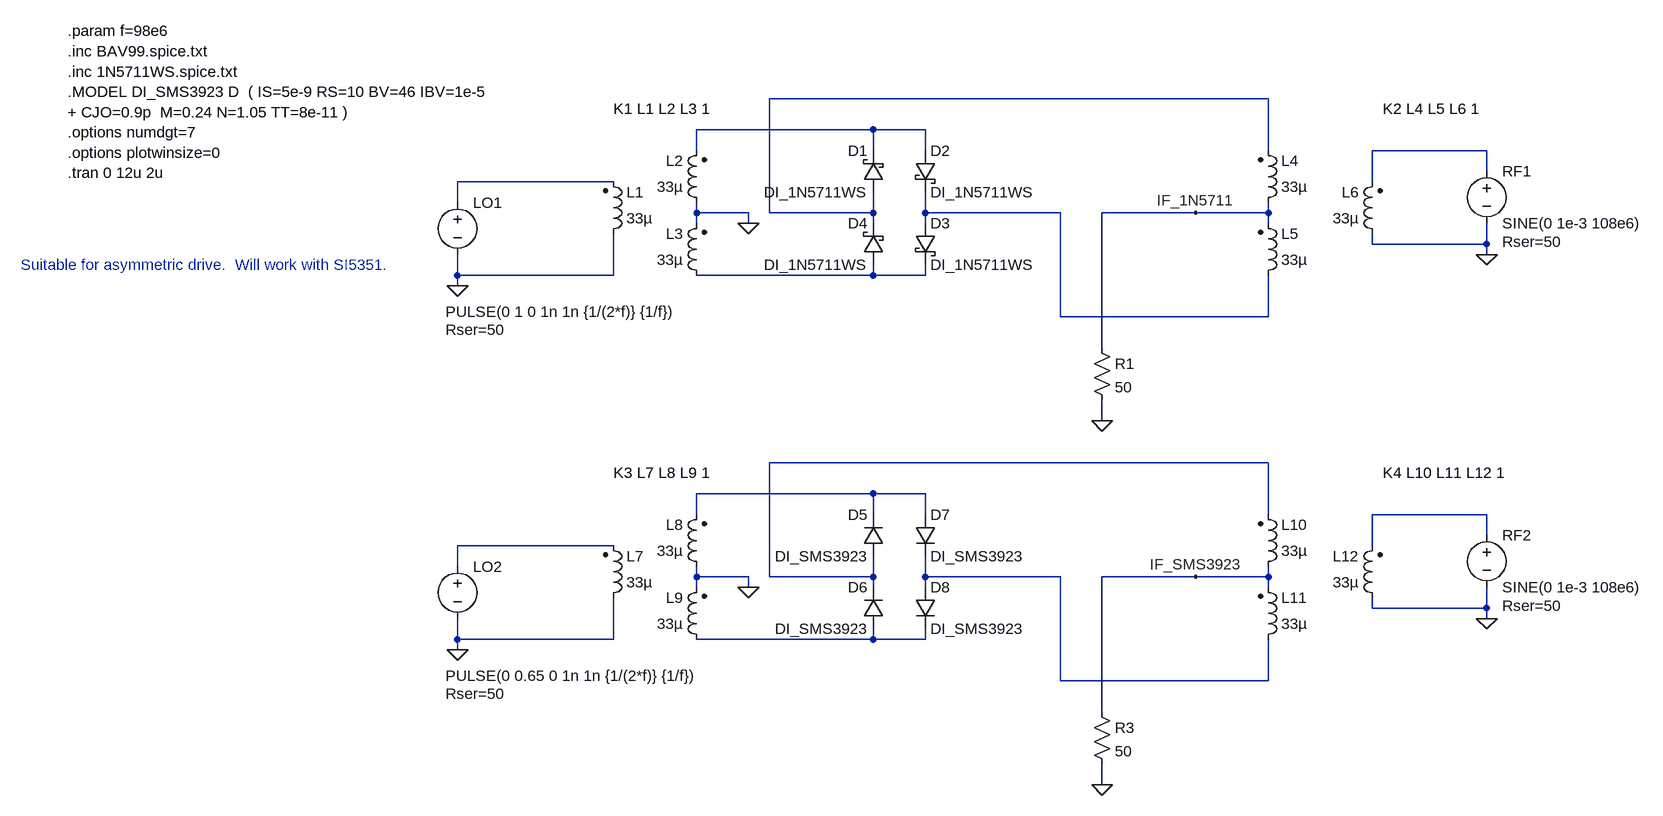
[diagram p0: schematic DBM_Diode_comparison.asc]
DBM_Diode_comparison.asc, the LTspice schematic file:
Version 4.1
SHEET 1 1380 964
WIRE 784 -112 16 -112
WIRE 176 -64 -96 -64
WIRE 256 -64 176 -64
WIRE -96 -32 -96 -64
WIRE 176 -32 176 -64
WIRE 256 -32 256 -64
WIRE 784 -32 784 -112
WIRE 1120 -32 944 -32
WIRE 1120 0 1120 -32
WIRE -224 16 -464 16
WIRE 944 16 944 -32
WIRE -464 48 -464 16
WIRE -96 64 -96 48
WIRE -16 64 -96 64
WIRE 16 64 16 -112
WIRE 176 64 176 32
WIRE 176 64 16 64
WIRE 256 64 256 32
WIRE 464 64 256 64
WIRE 672 64 528 64
WIRE 784 64 784 48
WIRE 784 64 672 64
WIRE -96 80 -96 64
WIRE -16 80 -16 64
WIRE 176 80 176 64
WIRE 256 80 256 64
WIRE 784 80 784 64
WIRE 944 112 944 96
WIRE 1120 112 1120 80
WIRE 1120 112 944 112
WIRE 1120 128 1120 112
WIRE -464 160 -464 128
WIRE -224 160 -224 96
WIRE -224 160 -464 160
WIRE 176 160 176 144
WIRE 176 160 -96 160
WIRE 256 160 256 144
WIRE 256 160 176 160
WIRE -464 176 -464 160
WIRE 464 224 464 64
WIRE 784 224 784 160
WIRE 784 224 464 224
WIRE 528 272 528 64
WIRE 528 384 528 352
WIRE 784 448 16 448
WIRE 176 496 -96 496
WIRE 256 496 176 496
WIRE -96 528 -96 496
WIRE 176 528 176 496
WIRE 256 528 256 496
WIRE 784 528 784 448
WIRE 1120 528 944 528
WIRE 1120 560 1120 528
WIRE -224 576 -464 576
WIRE 944 576 944 528
WIRE -464 608 -464 576
WIRE -96 624 -96 608
WIRE -16 624 -96 624
WIRE 16 624 16 448
WIRE 176 624 176 592
WIRE 176 624 16 624
WIRE 256 624 256 592
WIRE 464 624 256 624
WIRE 672 624 528 624
WIRE 784 624 784 608
WIRE 784 624 672 624
WIRE -96 640 -96 624
WIRE -16 640 -16 624
WIRE 176 640 176 624
WIRE 256 640 256 624
WIRE 784 640 784 624
WIRE 944 672 944 656
WIRE 1120 672 1120 640
WIRE 1120 672 944 672
WIRE 1120 688 1120 672
WIRE -464 720 -464 688
WIRE -224 720 -224 656
WIRE -224 720 -464 720
WIRE 176 720 176 704
WIRE 176 720 -96 720
WIRE 256 720 256 704
WIRE 256 720 176 720
WIRE -464 736 -464 720
WIRE 464 784 464 624
WIRE 784 784 784 720
WIRE 784 784 464 784
WIRE 528 832 528 624
WIRE 528 944 528 912
FLAG -16 80 0
FLAG -464 176 0
FLAG 1120 128 0
FLAG 528 384 0
FLAG 672 64 IF_1N5711
FLAG -16 640 0
FLAG -464 736 0
FLAG 1120 688 0
FLAG 528 944 0
FLAG 672 624 IF_SMS3923
DATAFLAG -368 576 ""
SYMBOL voltage -464 32 R0
WINDOW 3 -18 184 Left 2
WINDOW 123 0 0 Left 0
WINDOW 39 -18 212 Left 2
SYMATTR Value PULSE(0 1 0 1n 1n {1/(2*f)} {1/f})
SYMATTR SpiceLine Rser=50
SYMATTR InstName LO1
SYMBOL ind2 -240 112 M180
WINDOW 0 36 80 Left 2
WINDOW 3 36 40 Left 2
SYMATTR InstName L1
SYMATTR Value 33µ
SYMATTR Type ind
SYMBOL ind2 -80 64 R180
WINDOW 0 36 80 Left 2
WINDOW 3 36 40 Left 2
SYMATTR InstName L2
SYMATTR Value 33µ
SYMATTR Type ind
SYMBOL ind2 -80 176 R180
WINDOW 0 36 80 Left 2
WINDOW 3 36 40 Left 2
SYMATTR InstName L3
SYMATTR Value 33µ
SYMATTR Type ind
SYMBOL ind2 768 64 M180
WINDOW 0 36 80 Left 2
WINDOW 3 36 40 Left 2
SYMATTR InstName L4
SYMATTR Value 33µ
SYMATTR Type ind
SYMBOL ind2 768 176 M180
WINDOW 0 36 80 Left 2
WINDOW 3 36 40 Left 2
SYMATTR InstName L5
SYMATTR Value 33µ
SYMATTR Type ind
SYMBOL ind2 960 112 R180
WINDOW 0 36 80 Left 2
WINDOW 3 36 40 Left 2
SYMATTR InstName L6
SYMATTR Value 33µ
SYMATTR Type ind
SYMBOL schottky 192 32 R180
WINDOW 0 24 64 Left 2
WINDOW 3 24 0 Left 2
SYMATTR InstName D1
SYMATTR Value DI_1N5711WS
SYMATTR Description Diode
SYMATTR Type diode
SYMBOL voltage 1120 -16 R0
WINDOW 123 0 0 Left 0
WINDOW 39 24 124 Left 2
SYMATTR SpiceLine Rser=50
SYMATTR InstName RF1
SYMATTR Value SINE(0 1e-3 108e6)
SYMBOL res 512 256 R0
SYMATTR InstName R1
SYMATTR Value 50
SYMBOL schottky 240 -32 R0
SYMATTR InstName D2
SYMATTR Value DI_1N5711WS
SYMATTR Description Diode
SYMATTR Type diode
SYMBOL schottky 240 80 R0
SYMATTR InstName D3
SYMATTR Value DI_1N5711WS
SYMATTR Description Diode
SYMATTR Type diode
SYMBOL schottky 192 144 R180
WINDOW 0 24 64 Left 2
WINDOW 3 24 0 Left 2
SYMATTR InstName D4
SYMATTR Value DI_1N5711WS
SYMATTR Description Diode
SYMATTR Type diode
SYMBOL voltage -464 592 R0
WINDOW 3 -18 184 Left 2
WINDOW 123 0 0 Left 0
WINDOW 39 -18 212 Left 2
SYMATTR Value PULSE(0 0.65 0 1n 1n {1/(2*f)} {1/f})
SYMATTR SpiceLine Rser=50
SYMATTR InstName LO2
SYMBOL ind2 -240 672 M180
WINDOW 0 36 80 Left 2
WINDOW 3 36 40 Left 2
SYMATTR InstName L7
SYMATTR Value 33µ
SYMATTR Type ind
SYMBOL ind2 -80 624 R180
WINDOW 0 36 80 Left 2
WINDOW 3 36 40 Left 2
SYMATTR InstName L8
SYMATTR Value 33µ
SYMATTR Type ind
SYMBOL ind2 -80 736 R180
WINDOW 0 36 80 Left 2
WINDOW 3 36 40 Left 2
SYMATTR InstName L9
SYMATTR Value 33µ
SYMATTR Type ind
SYMBOL ind2 768 624 M180
WINDOW 0 36 80 Left 2
WINDOW 3 36 40 Left 2
SYMATTR InstName L10
SYMATTR Value 33µ
SYMATTR Type ind
SYMBOL ind2 768 736 M180
WINDOW 0 36 80 Left 2
WINDOW 3 36 40 Left 2
SYMATTR InstName L11
SYMATTR Value 33µ
SYMATTR Type ind
SYMBOL ind2 960 672 R180
WINDOW 0 36 80 Left 2
WINDOW 3 36 40 Left 2
SYMATTR InstName L12
SYMATTR Value 33µ
SYMATTR Type ind
SYMBOL voltage 1120 544 R0
WINDOW 123 0 0 Left 0
WINDOW 39 24 124 Left 2
SYMATTR SpiceLine Rser=50
SYMATTR InstName RF2
SYMATTR Value SINE(0 1e-3 108e6)
SYMBOL res 512 816 R0
SYMATTR InstName R3
SYMATTR Value 50
SYMBOL diode 192 592 R180
WINDOW 0 24 64 Left 2
WINDOW 3 24 0 Left 2
SYMATTR InstName D5
SYMATTR Value DI_SMS3923
SYMBOL diode 192 704 R180
WINDOW 0 24 64 Left 2
WINDOW 3 24 0 Left 2
SYMATTR InstName D6
SYMATTR Value DI_SMS3923
SYMBOL diode 240 528 R0
SYMATTR InstName D7
SYMATTR Value DI_SMS3923
SYMBOL diode 240 640 R0
SYMATTR InstName D8
SYMATTR Value DI_SMS3923
TEXT -224 -96 Left 2 !K1 L1 L2 L3 1
TEXT 960 -96 Left 2 !K2 L4 L5 L6 1
TEXT -1064 -216 Left 2 !.param f=98e6\n.inc BAV99.spice.txt\n.inc 1N5711WS.spice.txt\n.MODEL DI_SMS3923 D  ( IS=5e-9 RS=10 BV=46 IBV=1e-5\n+ CJO=0.9p  M=0.24 N=1.05 TT=8e-11 )\n.options numdgt=7\n.options plotwinsize=0\n.tran 0 12u 2u
TEXT -1136 144 Left 2 ;Suitable for asymmetric drive.  Will work with SI5351.
TEXT -224 464 Left 2 !K3 L7 L8 L9 1
TEXT 960 464 Left 2 !K4 L10 L11 L12 1

The netlist it stands for:
* DBM_Diode_comparison.asc
V§LO1 N004 0 PULSE(0 1 0 1n 1n {1/(2*f)} {1/f}) Rser=50
L1 0 N004 33µ
L2 0 N002 33µ
L3 N006 0 33µ
L4 IF_1N5711 N001 33µ
L5 N005 IF_1N5711 33µ
L6 0 N003 33µ
D1 N001 N002 DI_1N5711WS
V§RF1 N003 0 SINE(0 1e-3 108e6) Rser=50
R1 IF_1N5711 0 50
D2 N002 N005 DI_1N5711WS
D3 N005 N006 DI_1N5711WS
D4 N006 N001 DI_1N5711WS
V§LO2 N010 0 PULSE(0 0.65 0 1n 1n {1/(2*f)} {1/f}) Rser=50
L7 0 N010 33µ
L8 0 N008 33µ
L9 N012 0 33µ
L10 IF_SMS3923 N007 33µ
L11 N011 IF_SMS3923 33µ
L12 0 N009 33µ
V§RF2 N009 0 SINE(0 1e-3 108e6) Rser=50
R3 IF_SMS3923 0 50
D5 N007 N008 DI_SMS3923
D6 N012 N007 DI_SMS3923
D7 N008 N011 DI_SMS3923
D8 N011 N012 DI_SMS3923
.model D D
.lib standard.dio
K1 L1 L2 L3 1
K2 L4 L5 L6 1
.param f=98e6
.inc BAV99.spice.txt
.inc 1N5711WS.spice.txt
.MODEL DI_SMS3923 D  ( IS=5e-9 RS=10 BV=46 IBV=1e-5
+ CJO=0.9p  M=0.24 N=1.05 TT=8e-11 )
.options numdgt=7
.options plotwinsize=0
.tran 0 12u 2u
* Suitable for asymmetric drive.  Will work with SI5351.
K3 L7 L8 L9 1
K4 L10 L11 L12 1
.backanno
.end